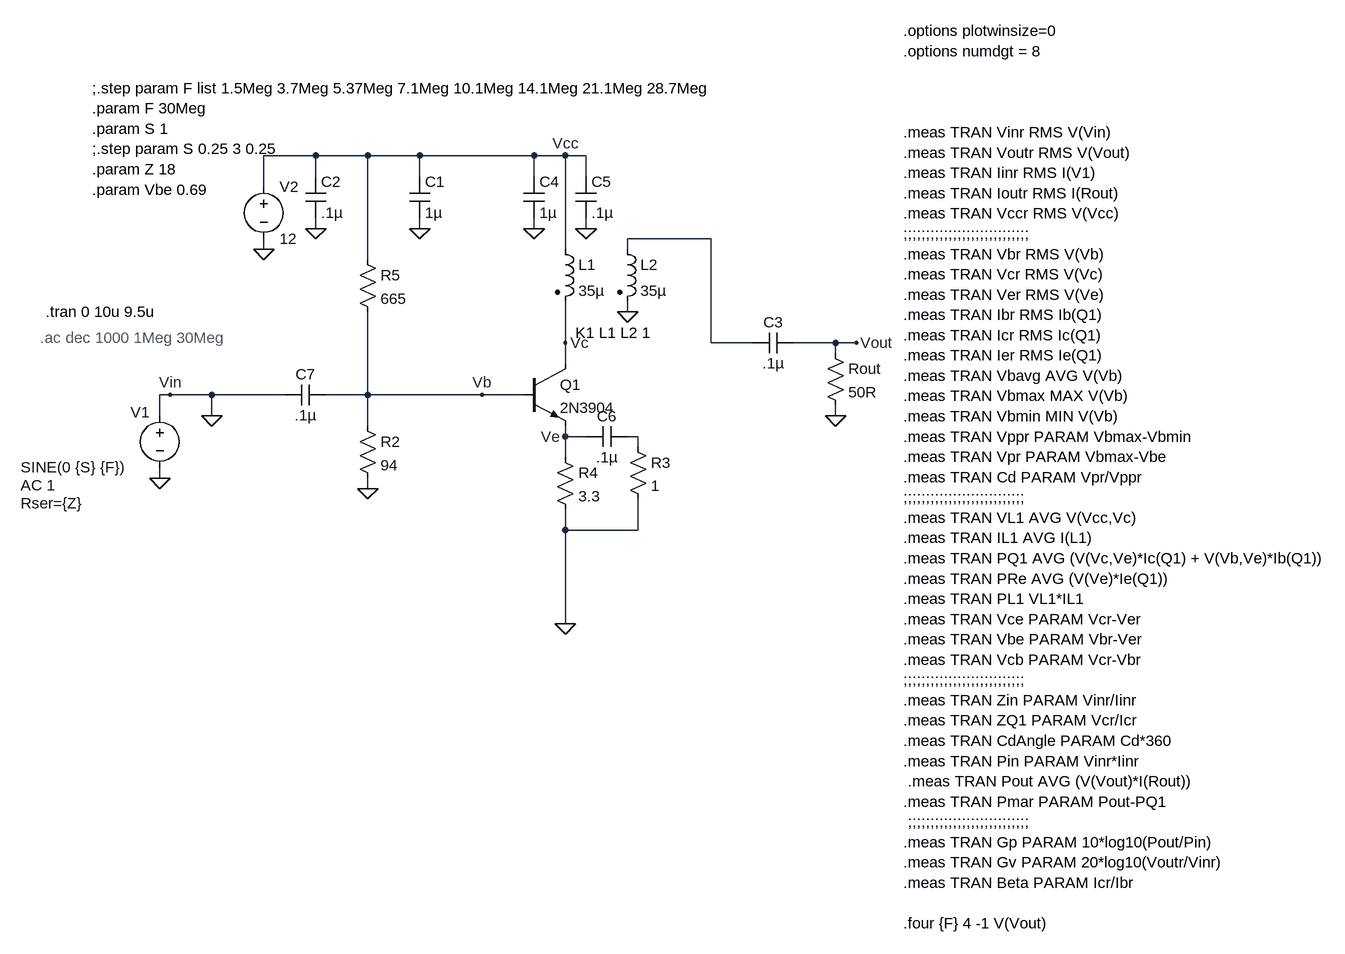
[diagram p0: schematic 2N3904 Vin vs Ic testing.asc]
2N3904 Vin vs Ic testing.asc, the LTspice schematic file:
Version 4
SHEET 1 1684 1496
WIRE 32 -176 -48 -176
WIRE 112 -176 32 -176
WIRE 192 -176 112 -176
WIRE 368 -176 192 -176
WIRE 416 -176 368 -176
WIRE 448 -176 416 -176
WIRE 32 -144 32 -176
WIRE 192 -144 192 -176
WIRE 368 -144 368 -176
WIRE 448 -144 448 -176
WIRE -48 -128 -48 -176
WIRE 32 -64 32 -80
WIRE 192 -64 192 -80
WIRE 368 -64 368 -80
WIRE 448 -64 448 -80
WIRE 640 -48 512 -48
WIRE -48 -32 -48 -48
WIRE 416 -32 416 -176
WIRE 512 -32 512 -48
WIRE 112 -16 112 -176
WIRE 512 64 512 48
WIRE 416 112 416 48
WIRE 640 112 640 -48
WIRE 704 112 640 112
WIRE 832 112 768 112
WIRE 864 112 832 112
WIRE 832 128 832 112
WIRE 416 144 416 112
WIRE -192 192 -208 192
WIRE -128 192 -192 192
WIRE -16 192 -128 192
WIRE 112 192 112 64
WIRE 112 192 48 192
WIRE 288 192 112 192
WIRE 352 192 288 192
WIRE -208 224 -208 192
WIRE -128 224 -128 192
WIRE 832 224 832 208
WIRE 112 240 112 192
WIRE 416 256 416 240
WIRE 448 256 416 256
WIRE 528 256 512 256
WIRE 528 272 528 256
WIRE 416 288 416 256
WIRE -208 320 -208 304
WIRE 112 336 112 320
WIRE 416 400 416 368
WIRE 528 400 528 352
WIRE 528 400 416 400
WIRE 416 544 416 400
FLAG 192 -64 0
FLAG 32 -64 0
FLAG -48 -32 0
FLAG -208 320 0
FLAG 112 336 0
FLAG 416 544 0
FLAG 864 112 Vout
FLAG 832 224 0
FLAG 368 -64 0
FLAG 448 -64 0
FLAG 288 192 Vb
FLAG 416 256 Ve
FLAG -192 192 Vin
FLAG 416 112 Vc
FLAG 512 64 0
FLAG 416 -176 Vcc
FLAG -128 224 0
SYMBOL npn 352 144 R0
SYMATTR InstName Q1
SYMATTR Value 2N3904
SYMBOL voltage -208 208 R0
WINDOW 0 -45 11 Left 2
WINDOW 3 -214 95 Left 2
WINDOW 123 -214 123 Left 2
WINDOW 39 -214 151 Left 2
SYMATTR InstName V1
SYMATTR Value SINE(0 {S} {F})
SYMATTR Value2 AC 1
SYMATTR SpiceLine Rser={Z}
SYMBOL voltage -48 -144 R0
WINDOW 123 0 0 Left 2
WINDOW 39 0 0 Left 2
SYMATTR InstName V2
SYMATTR Value 12
SYMBOL res 96 224 R0
SYMATTR InstName R2
SYMATTR Value 94
SYMBOL res 400 272 R0
SYMATTR InstName R4
SYMATTR Value 3.3
SYMBOL cap 176 -144 R0
SYMATTR InstName C1
SYMATTR Value 1µ
SYMBOL cap 16 -144 R0
SYMATTR InstName C2
SYMATTR Value .1µ
SYMBOL cap 768 96 R90
WINDOW 0 0 32 VBottom 2
WINDOW 3 32 32 VTop 2
SYMATTR InstName C3
SYMATTR Value .1µ
SYMBOL ind2 400 -48 R0
SYMATTR InstName L1
SYMATTR Value 35µ
SYMATTR Type ind
SYMBOL res 816 112 R0
SYMATTR InstName Rout
SYMATTR Value 50R
SYMBOL cap 352 -144 R0
SYMATTR InstName C4
SYMATTR Value 1µ
SYMBOL cap 432 -144 R0
SYMATTR InstName C5
SYMATTR Value .1µ
SYMBOL cap 48 176 R90
WINDOW 0 0 32 VBottom 2
WINDOW 3 32 32 VTop 2
SYMATTR InstName C7
SYMATTR Value .1µ
SYMBOL cap 512 240 R90
WINDOW 0 0 32 VBottom 2
WINDOW 3 32 32 VTop 2
SYMATTR InstName C6
SYMATTR Value .1µ
SYMBOL ind2 496 -48 R0
SYMATTR InstName L2
SYMATTR Value 35µ
SYMATTR Type ind
SYMBOL res 512 256 R0
SYMATTR InstName R3
SYMATTR Value 1
SYMBOL res 96 -32 R0
SYMATTR InstName R5
SYMATTR Value 665
TEXT -384 64 Left 2 !.tran 0 10u 9.5u
TEXT 936 -368 Left 2 !.options plotwinsize=0\n.options numdgt = 8\n \n \n \n.meas TRAN Vinr RMS V(Vin)\n.meas TRAN Voutr RMS V(Vout)\n.meas TRAN Iinr RMS I(V1)\n.meas TRAN Ioutr RMS I(Rout)\n.meas TRAN Vccr RMS V(Vcc)\n;;;;;;;;;;;;;;;;;;;;;;;;;;;;\n.meas TRAN Vbr RMS V(Vb)\n.meas TRAN Vcr RMS V(Vc)\n.meas TRAN Ver RMS V(Ve)\n.meas TRAN Ibr RMS Ib(Q1)\n.meas TRAN Icr RMS Ic(Q1)\n.meas TRAN Ier RMS Ie(Q1)\n.meas TRAN Vbavg AVG V(Vb)\n.meas TRAN Vbmax MAX V(Vb)\n.meas TRAN Vbmin MIN V(Vb)\n.meas TRAN Vppr PARAM Vbmax-Vbmin\n.meas TRAN Vpr PARAM Vbmax-Vbe\n.meas TRAN Cd PARAM Vpr/Vppr\n;;;;;;;;;;;;;;;;;;;;;;;;;;;\n.meas TRAN VL1 AVG V(Vcc,Vc)\n.meas TRAN IL1 AVG I(L1)\n.meas TRAN PQ1 AVG (V(Vc,Ve)*Ic(Q1) + V(Vb,Ve)*Ib(Q1))\n.meas TRAN PRe AVG (V(Ve)*Ie(Q1))\n.meas TRAN PL1 VL1*IL1\n.meas TRAN Vce PARAM Vcr-Ver\n.meas TRAN Vbe PARAM Vbr-Ver\n.meas TRAN Vcb PARAM Vcr-Vbr\n;;;;;;;;;;;;;;;;;;;;;;;;;;;\n.meas TRAN Zin PARAM Vinr/Iinr\n.meas TRAN ZQ1 PARAM Vcr/Icr\n.meas TRAN CdAngle PARAM Cd*360\n.meas TRAN Pin PARAM Vinr*Iinr\n .meas TRAN Pout AVG (V(Vout)*I(Rout))\n.meas TRAN Pmar PARAM Pout-PQ1\n ;;;;;;;;;;;;;;;;;;;;;;;;;;;\n.meas TRAN Gp PARAM 10*log10(Pout/Pin)\n.meas TRAN Gv PARAM 20*log10(Voutr/Vinr)\n.meas TRAN Beta PARAM Icr/Ibr\n \n.four {F} 4 -1 V(Vout)
TEXT -312 -280 Left 2 !;.step param F list 1.5Meg 3.7Meg 5.37Meg 7.1Meg 10.1Meg 14.1Meg 21.1Meg 28.7Meg\n.param F 30Meg\n.param S 1 \n;.step param S 0.25 3 0.25 \n.param Z 18\n.param Vbe 0.69
TEXT 432 96 Left 2 !K1 L1 L2 1
TEXT -392 104 Left 2 ;.ac dec 1000 1Meg 30Meg

The netlist it stands for:
* 2N3904 Vin vs Ic testing.asc
Q1 Vc Vb Ve 0 2N3904
V1 0 0 SINE(0 {S} {F}) AC 1 Rser={Z}
V2 Vcc 0 12
R2 Vb 0 94
R4 Ve 0 3.3
C1 Vcc 0 1µ
C2 Vcc 0 .1µ
C3 Vout N001 .1µ
L1 Vcc Vc 35µ
Rout Vout 0 50R
C4 Vcc 0 1µ
C5 Vcc 0 .1µ
C7 Vb 0 .1µ
C6 N002 Ve .1µ
L2 N001 0 35µ
R3 N002 0 1
R5 Vcc Vb 665
.model NPN NPN
.model PNP PNP
.lib standard.bjt
.tran 0 10u 9.5u
.options plotwinsize=0
.options numdgt = 8
.meas TRAN Vinr RMS V(Vin)
.meas TRAN Voutr RMS V(Vout)
.meas TRAN Iinr RMS I(V1)
.meas TRAN Ioutr RMS I(Rout)
.meas TRAN Vccr RMS V(Vcc)
;;;;;;;;;;;;;;;;;;;;;;;;;;;;
.meas TRAN Vbr RMS V(Vb)
.meas TRAN Vcr RMS V(Vc)
.meas TRAN Ver RMS V(Ve)
.meas TRAN Ibr RMS Ib(Q1)
.meas TRAN Icr RMS Ic(Q1)
.meas TRAN Ier RMS Ie(Q1)
.meas TRAN Vbavg AVG V(Vb)
.meas TRAN Vbmax MAX V(Vb)
.meas TRAN Vbmin MIN V(Vb)
.meas TRAN Vppr PARAM Vbmax-Vbmin
.meas TRAN Vpr PARAM Vbmax-Vbe
.meas TRAN Cd PARAM Vpr/Vppr
;;;;;;;;;;;;;;;;;;;;;;;;;;;
.meas TRAN VL1 AVG V(Vcc,Vc)
.meas TRAN IL1 AVG I(L1)
.meas TRAN PQ1 AVG (V(Vc,Ve)*Ic(Q1) + V(Vb,Ve)*Ib(Q1))
.meas TRAN PRe AVG (V(Ve)*Ie(Q1))
.meas TRAN PL1 VL1*IL1
.meas TRAN Vce PARAM Vcr-Ver
.meas TRAN Vbe PARAM Vbr-Ver
.meas TRAN Vcb PARAM Vcr-Vbr
;;;;;;;;;;;;;;;;;;;;;;;;;;;
.meas TRAN Zin PARAM Vinr/Iinr
.meas TRAN ZQ1 PARAM Vcr/Icr
.meas TRAN CdAngle PARAM Cd*360
.meas TRAN Pin PARAM Vinr*Iinr
 .meas TRAN Pout AVG (V(Vout)*I(Rout))
.meas TRAN Pmar PARAM Pout-PQ1
 ;;;;;;;;;;;;;;;;;;;;;;;;;;;
.meas TRAN Gp PARAM 10*log10(Pout/Pin)
.meas TRAN Gv PARAM 20*log10(Voutr/Vinr)
.meas TRAN Beta PARAM Icr/Ibr
.four {F} 4 -1 V(Vout)
;.step param F list 1.5Meg 3.7Meg 5.37Meg 7.1Meg 10.1Meg 14.1Meg 21.1Meg 28.7Meg
.param F 30Meg
.param S 1
;.step param S 0.25 3 0.25
.param Z 18
.param Vbe 0.69
K1 L1 L2 1
* .ac dec 1000 1Meg 30Meg
.backanno
.end